# Altium schematic sheet [07] - JTAG.SchDoc
size A3; DocumentNumber: 7; SheetNumber: 7; SheetTotal: 18
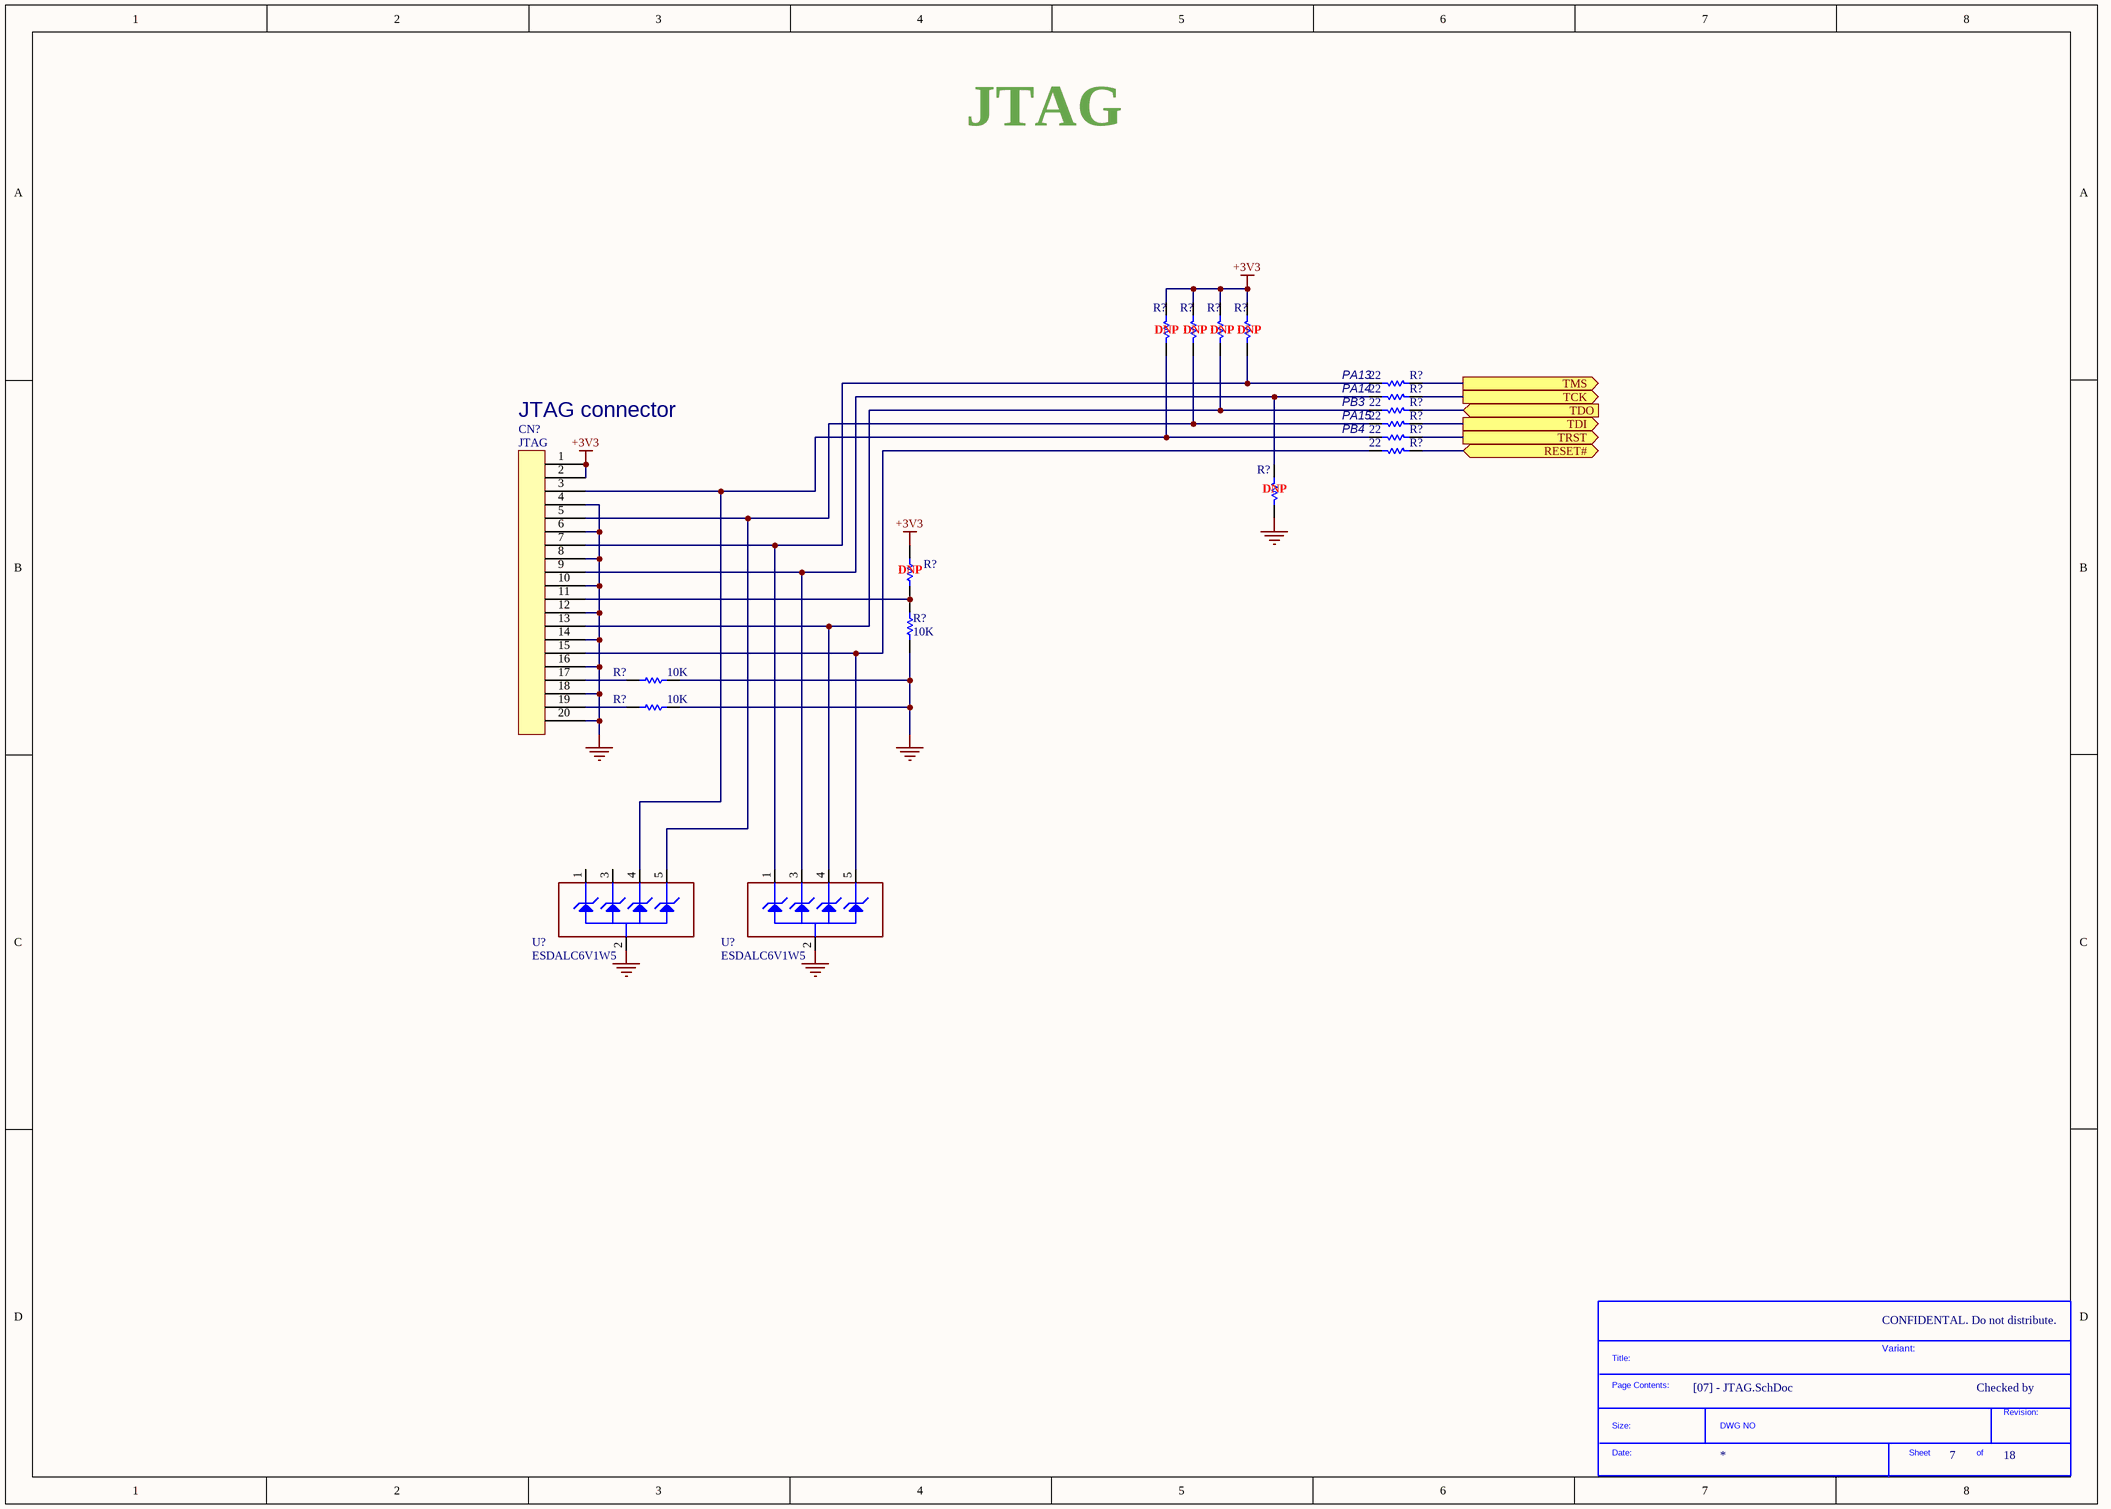
[diagram p0: [07] - JTAG.SchDoc]

## Parts
(Parts that share a designator on the sheet are numbered #1, #2 ... from top to bottom, then left to right.)
*  SDTitleBlock  (value not drawn)  (graphical)
CN?  JTAG  [IDC20S]
R?#1  [N/A]  [0603R]  (value not drawn)
R?#2  [N/A]  [0603R]  (value not drawn)
R?#3  [N/A]  [0603R]  (value not drawn)
R?#4  [N/A]  [0603R]  (value not drawn)
R?#5  22  [0603R]
R?#6  22  [0603R]
R?#7  22  [0603R]
R?#8  22  [0603R]
R?#9  22  [0603R]
R?#10  22  [0603R]
R?#11  [N/A]  [0603R]  (value not drawn)
R?#12  [N/A]  [0603R]  (value not drawn)
R?#13  10K  [0603R]
R?#14  10K  [0603R]
R?#15  10K  [0603R]
U?#1  ESDALC6V1W5  [SOT-353]
U?#2  ESDALC6V1W5  [SOT-353]

## Ports
RESET# (bidir), TCK (out), TDI (out), TDO (in), TMS (out), TRST (out)

## Nets
+3V3: CN?.1 CN?.2 R?#1.2 R?#2.2 R?#3.2 R?#4.2 R?#12.2
GND: CN?.4 CN?.6 CN?.8 CN?.10 CN?.12 CN?.14 CN?.16 CN?.18 CN?.20 R?#11.1 R?#13.1 R?#14.1 R?#15.1 U?#1.2(GND) U?#2.2(GND)
RESET#: R?#10.2 ; port RESET#
TCK: R?#6.2 ; port TCK
TDI: R?#8.2 ; port TDI
TDO: R?#7.2 ; port TDO
TMS: R?#5.2 ; port TMS
TRST: R?#9.2 ; port TRST
NetCN?_3: CN?.3 R?#1.1 R?#9.1 U?#1.4(IO3)
NetCN?_5: CN?.5 R?#2.1 R?#8.1 U?#1.5(IO4)
NetCN?_7: CN?.7 R?#4.1 R?#5.1 U?#2.1(IO1)
NetCN?_9: CN?.9 R?#6.1 R?#11.2 U?#2.3(IO2)
NetCN?_11: CN?.11 R?#12.1 R?#13.2
NetCN?_13: CN?.13 R?#3.1 R?#7.1 U?#2.4(IO3)
NetCN?_15: CN?.15 R?#10.1 U?#2.5(IO4)
NetCN?_17: CN?.17 R?#14.2
NetCN?_19: CN?.19 R?#15.2

Not connected (* = marked no-connect by the designer): U?#1 1(IO1) 3(IO2)

## Notes on the sheet
- JTAG
- (near R?#1) DNP
- (near R?#2) DNP
- (near R?#3) DNP
- (near R?#4) DNP
- (near R?#5) PA13
- (near CN?) JTAG connector
- (near R?#5) PA14
- (near R?#6) PB3
- (near R?#7) PA15
- (near R?#8) PB4
- (near R?#11) DNP
- (near R?#10) CLOCKS (CPU & PCIE)
- (near R?#12) DNP
- CONFIDENTAL. Do not distribute.
- Variant:
- Checked by
- (in symbol SDTitleBlock) Title:; Page Contents:; Revision:; Size:; DWG NO; Date:; Sheet; of

## Library data of the parts
CN? = 20PIN1
R?#1-R?#15 = Res1: Resistor; Value: 1K; Published: 8-Jun-2000; Revision: July-2002: Re-released for DXP Platform.; Publisher: Altium Limited
U?#1 U?#2 = ESDALC6V1W5: Dual Transil array for ESD protection; Manuf_1: STM; Manuf_Part_1: ESDA5V3L; Ref St: 9179034; Provided: ST; ECCN_US/EU: EAR99/NEC; Distrib: ST; Order: ESDA5V3L; Ordered by: STM